# Altium schematic sheet LTC6803-3.SchDoc
size A3
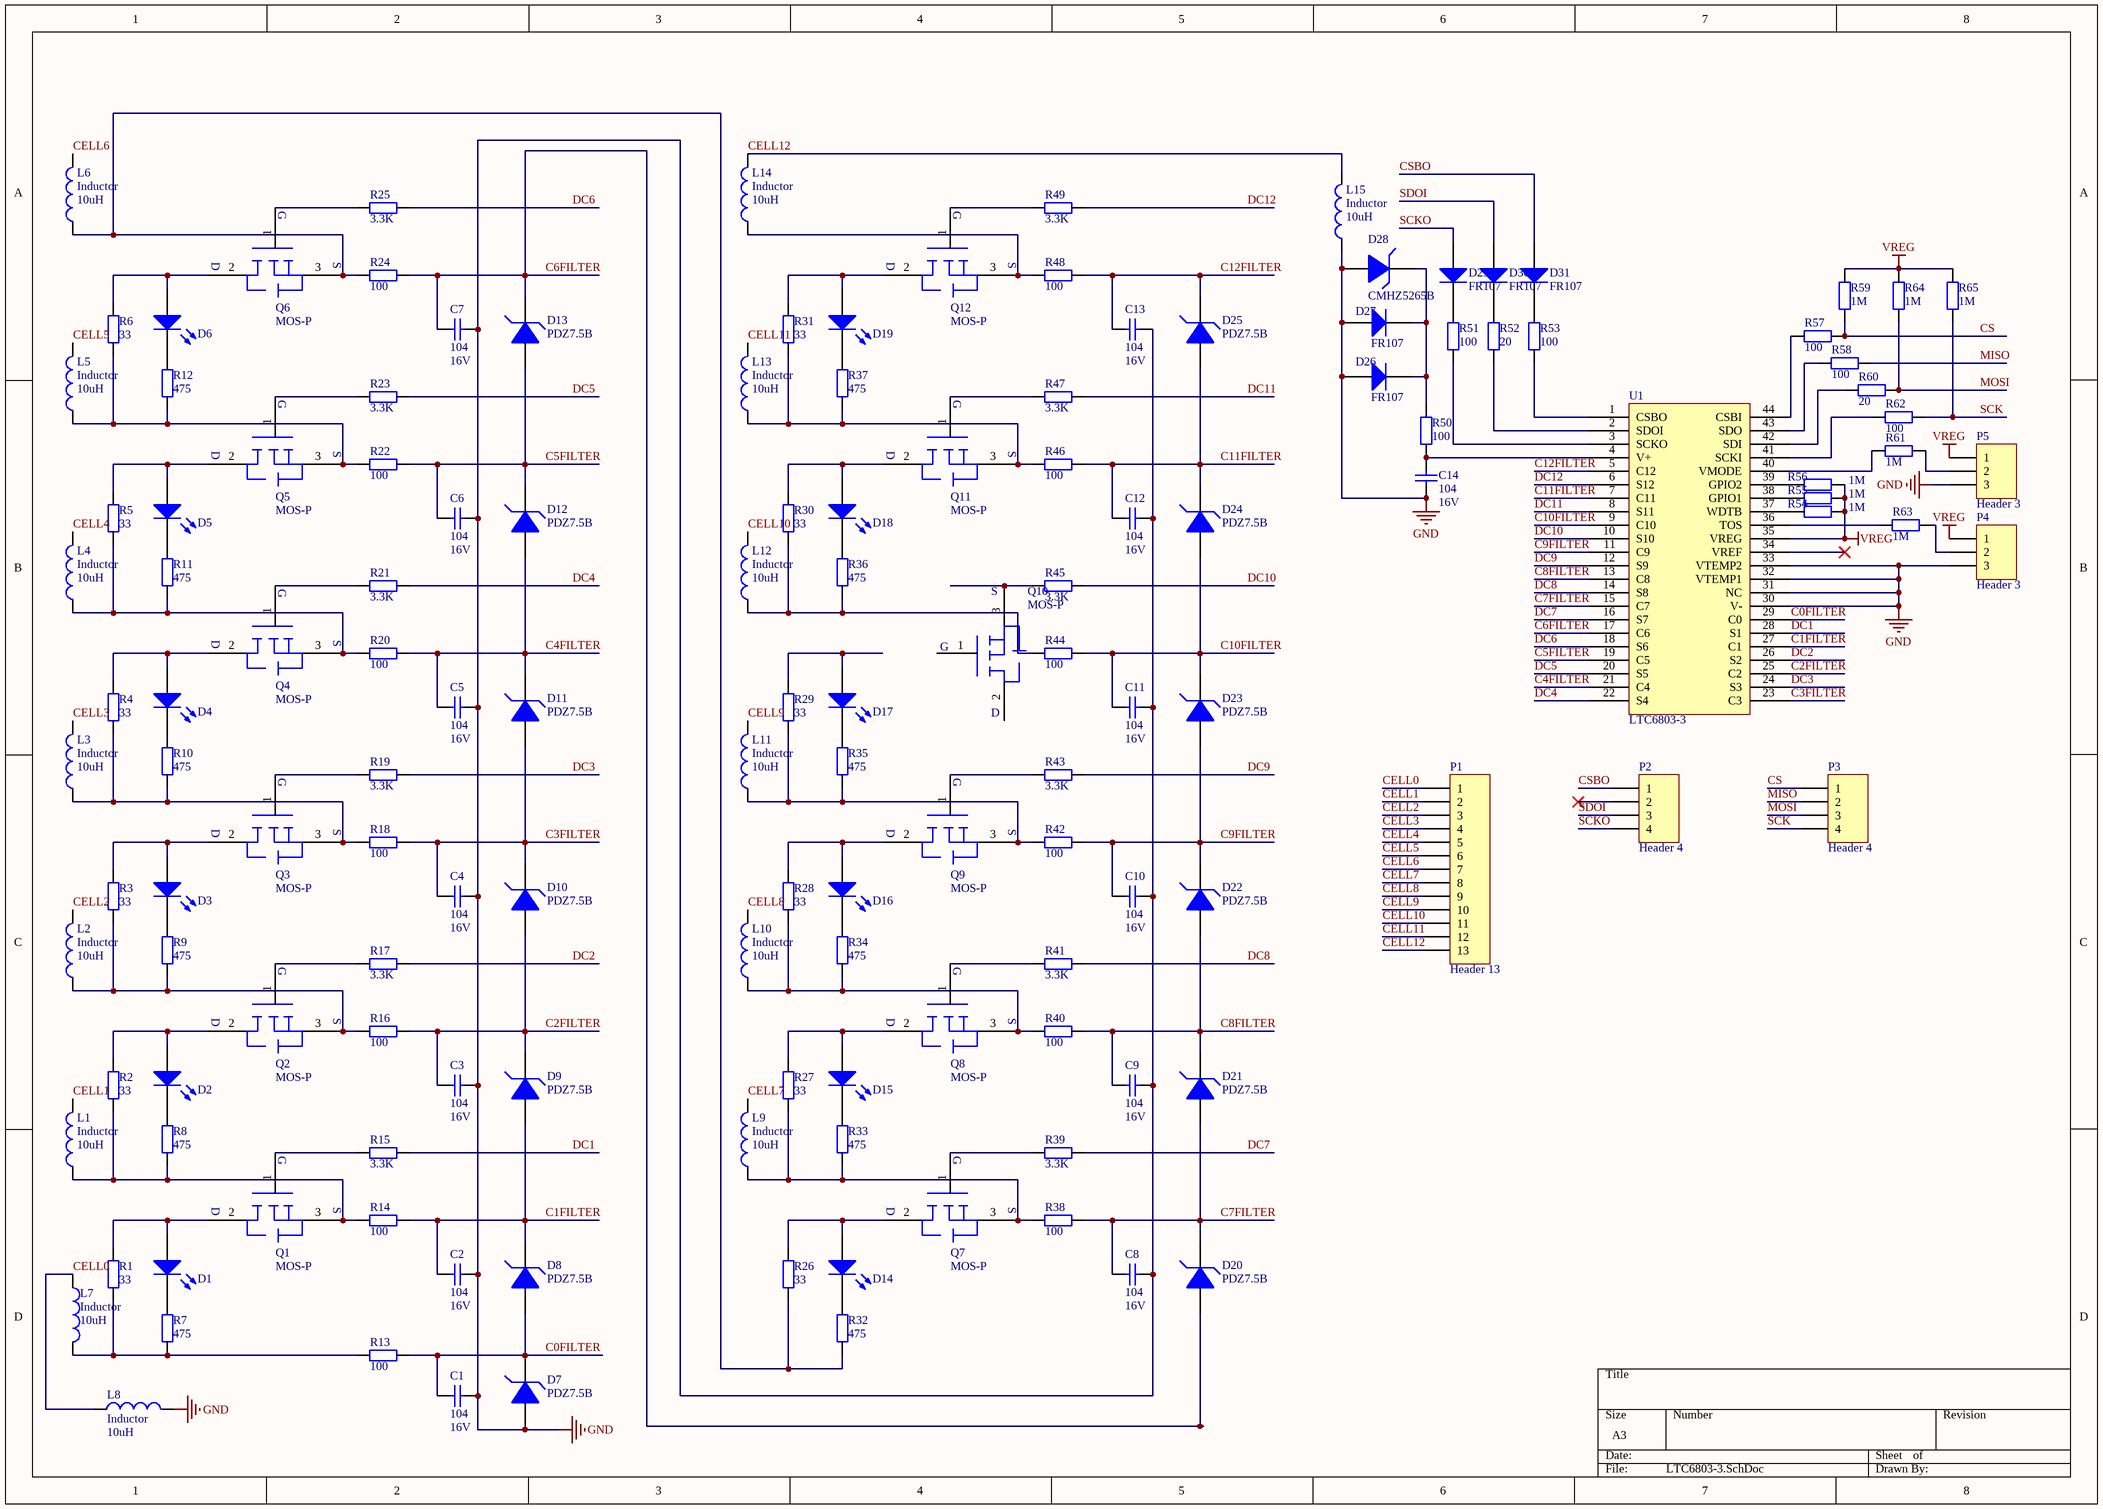
[diagram p0: LTC6803-3.SchDoc]

## Parts
C1  value 104  Pressure Voltage: 16V  [1206]  (hidden comment: Cap)
C2  value 104  Pressure Voltage: 16V  [1206]  (hidden comment: Cap)
C3  value 104  Pressure Voltage: 16V  [1206]  (hidden comment: Cap)
C4  value 104  Pressure Voltage: 16V  [1206]  (hidden comment: Cap)
C5  value 104  Pressure Voltage: 16V  [1206]  (hidden comment: Cap)
C6  value 104  Pressure Voltage: 16V  [1206]  (hidden comment: Cap)
C7  value 104  Pressure Voltage: 16V  [1206]  (hidden comment: Cap)
C8  value 104  Pressure Voltage: 16V  [1206]  (hidden comment: Cap)
C9  value 104  Pressure Voltage: 16V  [1206]  (hidden comment: Cap)
C10  value 104  Pressure Voltage: 16V  [1206]  (hidden comment: Cap)
C11  value 104  Pressure Voltage: 16V  [1206]  (hidden comment: Cap)
C12  value 104  Pressure Voltage: 16V  [1206]  (hidden comment: Cap)
C13  value 104  Pressure Voltage: 16V  [1206]  (hidden comment: Cap)
C14  value 104  Pressure Voltage: 16V  [1206]  (hidden comment: Cap)
D1  LED  [LED_0805]  (value not drawn)
D2  LED  [LED_0805]  (value not drawn)
D3  LED  [LED_0805]  (value not drawn)
D4  LED  [LED_0805]  (value not drawn)
D5  LED  [LED_0805]  (value not drawn)
D6  LED  [LED_0805]  (value not drawn)
D7  PDZ7.5B  [SODFL250X110-2N]
D8  PDZ7.5B  [SODFL250X110-2N]
D9  PDZ7.5B  [SODFL250X110-2N]
D10  PDZ7.5B  [SODFL250X110-2N]
D11  PDZ7.5B  [SODFL250X110-2N]
D12  PDZ7.5B  [SODFL250X110-2N]
D13  PDZ7.5B  [SODFL250X110-2N]
D14  LED  [LED_0805]  (value not drawn)
D15  LED  [LED_0805]  (value not drawn)
D16  LED  [LED_0805]  (value not drawn)
D17  LED  [LED_0805]  (value not drawn)
D18  LED  [LED_0805]  (value not drawn)
D19  LED  [LED_0805]  (value not drawn)
D20  PDZ7.5B  [SODFL250X110-2N]
D21  PDZ7.5B  [SODFL250X110-2N]
D22  PDZ7.5B  [SODFL250X110-2N]
D23  PDZ7.5B  [SODFL250X110-2N]
D24  PDZ7.5B  [SODFL250X110-2N]
D25  PDZ7.5B  [SODFL250X110-2N]
D26  FR107  [DIO-214]
D27  FR107  [DIO-214]
D28  CMHZ5265B  [SODFL372X135-2N]
D29  FR107  [DIO-214]
D30  FR107  [DIO-214]
D31  FR107  [DIO-214]
L1  Inductor  value 10uH  [0805_Inductor]
L2  Inductor  value 10uH  [0805_Inductor]
L3  Inductor  value 10uH  [0805_Inductor]
L4  Inductor  value 10uH  [0805_Inductor]
L5  Inductor  value 10uH  [0805_Inductor]
L6  Inductor  value 10uH  [0805_Inductor]
L7  Inductor  value 10uH  [0805_Inductor]
L8  Inductor  value 10uH  [0805_Inductor]
L9  Inductor  value 10uH  [0805_Inductor]
L10  Inductor  value 10uH  [0805_Inductor]
L11  Inductor  value 10uH  [0805_Inductor]
L12  Inductor  value 10uH  [0805_Inductor]
L13  Inductor  value 10uH  [0805_Inductor]
L14  Inductor  value 10uH  [0805_Inductor]
L15  Inductor  value 10uH  [0805_Inductor]
P1  Header 13  [HDR1X13]
P2  Header 4  [HDR1X4]
P3  Header 4  [HDR1X4]
P4  Header 3  [HDR1X3]
P5  Header 3  [HDR1X3]
Q1  MOS-P  [SOT23_N]
Q2  MOS-P  [SOT23_N]
Q3  MOS-P  [SOT23_N]
Q4  MOS-P  [SOT23_N]
Q5  MOS-P  [SOT23_N]
Q6  MOS-P  [SOT23_N]
Q7  MOS-P  [SOT23_N]
Q8  MOS-P  [SOT23_N]
Q9  MOS-P  [SOT23_N]
Q10  MOS-P  [SOT23_N]
Q11  MOS-P  [SOT23_N]
Q12  MOS-P  [SOT23_N]
R1  value 33  [2512-RESC6332X06N]  (hidden comment: Res)
R2  value 33  [2512-RESC6332X06N]  (hidden comment: Res)
R3  value 33  [2512-RESC6332X06N]  (hidden comment: Res)
R4  value 33  [2512-RESC6332X06N]  (hidden comment: Res)
R5  value 33  [2512-RESC6332X06N]  (hidden comment: Res)
R6  value 33  [2512-RESC6332X06N]  (hidden comment: Res)
R7  value 475  [0805]  (hidden comment: Res)
R8  value 475  [0805]  (hidden comment: Res)
R9  value 475  [0805]  (hidden comment: Res)
R10  value 475  [0805]  (hidden comment: Res)
R11  value 475  [0805]  (hidden comment: Res)
R12  value 475  [0805]  (hidden comment: Res)
R13  value 100  [0805]  (hidden comment: Res)
R14  value 100  [0805]  (hidden comment: Res)
R15  value 3.3K  [0805]  (hidden comment: Res)
R16  value 100  [0805]  (hidden comment: Res)
R17  value 3.3K  [0805]  (hidden comment: Res)
R18  value 100  [0805]  (hidden comment: Res)
R19  value 3.3K  [0805]  (hidden comment: Res)
R20  value 100  [0805]  (hidden comment: Res)
R21  value 3.3K  [0805]  (hidden comment: Res)
R22  value 100  [0805]  (hidden comment: Res)
R23  value 3.3K  [0805]  (hidden comment: Res)
R24  value 100  [0805]  (hidden comment: Res)
R25  value 3.3K  [0805]  (hidden comment: Res)
R26  value 33  [2512-RESC6332X06N]  (hidden comment: Res)
R27  value 33  [2512-RESC6332X06N]  (hidden comment: Res)
R28  value 33  [2512-RESC6332X06N]  (hidden comment: Res)
R29  value 33  [2512-RESC6332X06N]  (hidden comment: Res)
R30  value 33  [2512-RESC6332X06N]  (hidden comment: Res)
R31  value 33  [2512-RESC6332X06N]  (hidden comment: Res)
R32  value 475  [0805]  (hidden comment: Res)
R33  value 475  [0805]  (hidden comment: Res)
R34  value 475  [0805]  (hidden comment: Res)
R35  value 475  [0805]  (hidden comment: Res)
R36  value 475  [0805]  (hidden comment: Res)
R37  value 475  [0805]  (hidden comment: Res)
R38  value 100  [0805]  (hidden comment: Res)
R39  value 3.3K  [0805]  (hidden comment: Res)
R40  value 100  [0805]  (hidden comment: Res)
R41  value 3.3K  [0805]  (hidden comment: Res)
R42  value 100  [0805]  (hidden comment: Res)
R43  value 3.3K  [0805]  (hidden comment: Res)
R44  value 100  [0805]  (hidden comment: Res)
R45  value 3.3K  [0805]  (hidden comment: Res)
R46  value 100  [0805]  (hidden comment: Res)
R47  value 3.3K  [0805]  (hidden comment: Res)
R48  value 100  [0805]  (hidden comment: Res)
R49  value 3.3K  [0805]  (hidden comment: Res)
R50  value 100  [0805]  (hidden comment: Res)
R51  value 100  [0805]  (hidden comment: Res)
R52  value 20  [0805]  (hidden comment: Res)
R53  value 100  [0805]  (hidden comment: Res)
R54  value 1M  [0805]  (hidden comment: Res)
R55  value 1M  [0805]  (hidden comment: Res)
R56  value 1M  [0805]  (hidden comment: Res)
R57  value 100  [0805]  (hidden comment: Res)
R58  value 100  [0805]  (hidden comment: Res)
R59  value 1M  [0805]  (hidden comment: Res)
R60  value 20  [0805]  (hidden comment: Res)
R61  value 1M  [0805]  (hidden comment: Res)
R62  value 100  [0805]  (hidden comment: Res)
R63  value 1M  [0805]  (hidden comment: Res)
R64  value 1M  [0805]  (hidden comment: Res)
R65  value 1M  [0805]  (hidden comment: Res)
U1  LTC6803-3  [SSOP50P780X200-44N]

## Nets
GND: C1.2 C2.2 C3.2 C4.2 C5.2 C6.2 C7.2 C8.2 C9.2 C10.2 C11.2 C12.2 C13.2 C14.1 D7.1(A) D26.1(A) D27.1(A) D28.1(A) L8.2 L15.1 P4.3 P5.3 U1.30(V-) U1.31(NC) U1.32(VTEMP1) U1.33(VTEMP2)
VREG: P4.1 P5.1 R54.1 R55.1 R56.1 R59.1 R64.1 R65.1 U1.35(VREG)
C0FILTER: C1.1 D7.2(K) D8.1(A) R13.2 U1.29(C0)
C1FILTER: C2.1 D8.2(K) D9.1(A) R14.2 U1.27(C1)
C2FILTER: C3.1 D9.2(K) D10.1(A) R16.2 U1.25(C2)
C3FILTER: C4.1 D10.2(K) D11.1(A) R18.2 U1.23(C3)
C4FILTER: C5.1 D11.2(K) D12.1(A) R20.2 U1.21(C4)
C5FILTER: C6.1 D12.2(K) D13.1(A) R22.2 U1.19(C5)
C6FILTER: C7.1 D13.2(K) D20.1(A) R24.2 U1.17(C6)
C7FILTER: C8.1 D20.2(K) D21.1(A) R38.2 U1.15(C7)
C8FILTER: C9.1 D21.2(K) D22.1(A) R40.2 U1.13(C8)
C9FILTER: C10.1 D22.2(K) D23.1(A) R42.2 U1.11(C9)
C10FILTER: C11.1 D23.2(K) D24.1(A) R44.2 U1.9(C10)
C11FILTER: C12.1 D24.2(K) D25.1(A) R46.2 U1.7(C11)
C12FILTER: C13.1 D25.2(K) R48.2 U1.5(C12)
CELL0: L7.1 L8.1 P1.1
CELL1: L1.2 P1.2
CELL2: L2.2 P1.3
CELL3: L3.2 P1.4
CELL4: L4.2 P1.5
CELL5: L5.2 P1.6
CELL6: L6.2 P1.7
CELL7: L9.2 P1.8
CELL8: L10.2 P1.9
CELL9: L11.2 P1.10
CELL10: L12.2 P1.11
CELL11: L13.2 P1.12
CELL12: L14.2 L15.2 P1.13
CS: P3.1 R57.1 R59.2
CSBO: D31.1(A) P2.1
DC1: R15.2 U1.28(S1)
DC2: R17.2 U1.26(S2)
DC3: R19.2 U1.24(S3)
DC4: R21.2 U1.22(S4)
DC5: R23.2 U1.20(S5)
DC6: R25.2 U1.18(S6)
DC7: R39.2 U1.16(S7)
DC8: R41.2 U1.14(S8)
DC9: R43.2 U1.12(S9)
DC10: R45.2 U1.10(S10)
DC11: R47.2 U1.8(S11)
DC12: R49.2 U1.6(S12)
MISO: P3.2 R58.1
MOSI: P3.3 R60.1 R64.2
SCK: P3.4 R62.1 R65.2
SCKO: D29.1(A) P2.4
SDOI: D30.1(A) P2.3
NetC14_2: C14.2 R50.1 U1.4(V+)
NetD1_1: D1.1(A) Q1.2 R1.2
NetD1_2: D1.2(K) R7.2
NetD2_1: D2.1(A) Q2.2 R2.2
NetD2_2: D2.2(K) R8.2
NetD3_1: D3.1(A) Q3.2 R3.2
NetD3_2: D3.2(K) R9.2
NetD4_1: D4.1(A) Q4.2 R4.2
NetD4_2: D4.2(K) R10.2
NetD5_1: D5.1(A) Q5.2 R5.2
NetD5_2: D5.2(K) R11.2
NetD6_1: D6.1(A) Q6.2 R6.2
NetD6_2: D6.2(K) R12.2
NetD14_1: D14.1(A) Q7.2 R26.2
NetD14_2: D14.2(K) R32.2
NetD15_1: D15.1(A) Q8.2 R27.2
NetD15_2: D15.2(K) R33.2
NetD16_1: D16.1(A) Q9.2 R28.2
NetD16_2: D16.2(K) R34.2
NetD17_1: D17.1(A) R29.2
NetD17_2: D17.2(K) R35.2
NetD18_1: D18.1(A) Q11.2 R30.2
NetD18_2: D18.2(K) R36.2
NetD19_1: D19.1(A) Q12.2 R31.2
NetD19_2: D19.2(K) R37.2
NetD26_2: D26.2(K) D27.2(K) D28.2(K) R50.2
NetD29_2: D29.2(K) R51.2
NetD30_2: D30.2(K) R52.2
NetD31_2: D31.2(K) R53.2
NetL1_1: L1.1 Q1.3 R2.1 R8.1 R14.1
NetL2_1: L2.1 Q2.3 R3.1 R9.1 R16.1
NetL3_1: L3.1 Q3.3 R4.1 R10.1 R18.1
NetL4_1: L4.1 Q4.3 R5.1 R11.1 R20.1
NetL5_1: L5.1 Q5.3 R6.1 R12.1 R22.1
NetL6_1: L6.1 Q6.3 R24.1 R26.1 R32.1
NetL7_2: L7.2 R1.1 R7.1 R13.1
NetL9_1: L9.1 Q7.3 R27.1 R33.1 R38.1
NetL10_1: L10.1 Q8.3 R28.1 R34.1 R40.1
NetL11_1: L11.1 Q9.3 R29.1 R35.1 R42.1
NetL12_1: L12.1 R30.1 R36.1 R44.1
NetL13_1: L13.1 Q11.3 R31.1 R37.1 R46.1
NetL14_1: L14.1 Q12.3 R48.1
NetP4_2: P4.2 R63.1
NetP5_2: P5.2 R61.1
NetQ1_1: Q1.1(G) R15.1
NetQ2_1: Q2.1(G) R17.1
NetQ3_1: Q3.1(G) R19.1
NetQ4_1: Q4.1(G) R21.1
NetQ5_1: Q5.1(G) R23.1
NetQ6_1: Q6.1(G) R25.1
NetQ7_1: Q7.1(G) R39.1
NetQ8_1: Q8.1(G) R41.1
NetQ9_1: Q9.1(G) R43.1
NetQ10_3: Q10.3 R45.1
NetQ11_1: Q11.1(G) R47.1
NetQ12_1: Q12.1(G) R49.1
NetR51_1: R51.1 U1.3(SCKO)
NetR52_1: R52.1 U1.2(SDOI)
NetR53_1: R53.1 U1.1(CSBO)
NetR54_2: R54.2 U1.37(WDTB)
NetR55_2: R55.2 U1.38(GPIO1)
NetR56_2: R56.2 U1.39(GPIO2)
NetR57_2: R57.2 U1.44(CSBI)
NetR58_2: R58.2 U1.43(SDO)
NetR60_2: R60.2 U1.42(SDI)
NetR61_2: R61.2 U1.40(VMODE)
NetR62_2: R62.2 U1.41(SCKI)
NetR63_2: R63.2 U1.36(TOS)

Not connected (* = marked no-connect by the designer): P2 2*; Q10 1(G) 2; U1 34(VREF)*

## Notes on the sheet
- (in symbol MOS-P) D; S

## Library data of the parts
C1-C14 = Cap: 原理图绘制者: 刘永钦; 原理图何处使用过: 2014年飞思卡尔底板; 原理图审核人1: 徐鹏飞; 封装0805何处使用: 2015年航行器遥控器; 原理图审核人2: 朱觉文; 封装0603何处使用过: 在2401转接板上使用; 原理图提供者: 刘永钦; 封装0805绘制者: 刘永钦; 封装0805提供者: 刘永钦; 封装0805审核人1: 徐鹏飞; 封装0805审核人2: 朱觉文; 封装0603绘制者: 刘永钦; 封装0603提供者: 刘永钦; 封装0603审核人1: 朱觉文; 封装0603审核人2: 徐鹏飞
D1-D6 D14-D19 = LED: 原理图绘制者: 刘永钦; 原理图何处使用过: 2014年飞思卡尔底板; 原理图审核人1: 徐鹏飞; Color: 蓝色; 封装1210LED何处使用过: 2014年的一个小板子; 封装LED_3mm何处使用过: 2014年变频器面板; 封装LED_0805使用过: 2015年飞思卡尔底板; 原理图审核人2: 朱觉文; 封装LED0603何处使用过: 2401转接板; 原理图提供者: 刘永钦; 封装1210LED绘制者: 刘永钦; 封装1210LED提供者: 刘永钦; 封装1210LED审核人1: 徐鹏飞; 封装LED_3mm绘制者: 刘永钦; 封装LED_3mm提供者: 刘永钦; 封装LED_0805绘制者: 刘永钦; 封装LED_0805提供者: 刘永钦; 封装LED_0805审核人1: 徐鹏飞; 封装1210LED审核人2: 朱觉文; 封装LED_0805审核人2: 朱觉文; 封装LED_3mm审核者2: 朱觉文; 封装LED0603绘制者: 刘永钦; 封装LED0603审核人2: 朱觉文; 封装LED0603提供者: 刘永钦; 封装LED0603审核人1: 徐鹏飞
D26 D27 D29-D31 = 二极管: 原理图绘制者: 赵某某; 原理图提供者: 周某某; 原理图何处使用过: 2014年飞思卡尔运放板; 原理图审核人: 李某某; 封装DIO-214绘制者: 刘永钦; 封装DIO-214审核人1: 徐鹏飞; 封装DIO-214审核人2: 朱觉文; 封装DIO-214提供者: 刘永钦; 封装DIO-214何处使用过: 2014年飞思卡尔运放板
D28 = CMHZ5265B: 62V Zener Diode
L1-L15 = Inductor: 原理图绘制者: 刘永钦; 原理图何处使用过: 2014年飞思卡尔底板; 原理图审核人1: 徐鹏飞; 封装0805_Inductor绘制者: 未知; 封装0805_Inductor使用过: 2015年飞思卡尔底板; 原理图审核人2: 朱觉文; 原理图提供者: 刘永钦; 封装0805_Inductor提供者: 刘永钦; 封装0805_Inductor审核人1: 徐鹏飞; 封装0805_Inductor审核人2: 朱觉文
P1 = Header 13: Header, 13-Pin; LatestRevisionDate: 17-Jul-2002; LatestRevisionNote: Re-released for DXP Platform.; Publisher: Altium Limited
P2 P3 = Header 4: Header, 4-Pin; LatestRevisionDate: 17-Jul-2002; LatestRevisionNote: Re-released for DXP Platform.; Publisher: Altium Limited
P4 P5 = Header 3: Header, 3-Pin; LatestRevisionDate: 17-Jul-2002; LatestRevisionNote: Re-released for DXP Platform.; Publisher: Altium Limited
Q1-Q12 = MOS-P: 原理图审核人2: 朱觉文; 原理图绘制者: 刘永钦; 原理图审核人1: 徐鹏飞; 原理图何处使用过: 无刷直流电机驱动板; 原理图提供者: 刘永钦; 封装MOS_TO-220提供者: 刘永钦; 封装MOS_TO-220审核人1: 徐鹏飞; 封装MOS_TO-220审核人2: 朱觉文; 封装MOS_TO-220何处使用过: 无刷直流电机驱动板; 封装MOS_TO-220绘制者: 刘永钦
R1-R65 = Res: 原理图绘制者: 刘永钦; 原理图何处使用过: 2014年飞思卡尔底板; 原理图审核人1: 徐鹏飞; 封装0805何处使用过: 2015年航行器遥控器; 原理图审核人2: 朱觉文; 封装2512-RESC6332X06N何处使用过: 在无刷直流电机驱动板上使用过; 封装0603何处使用过: 在2401转接板上使用; 原理图提供者: 刘永钦; 封装0805绘制者: 刘永钦; 封装0805提供者: 刘永钦; 封装0805审核人1: 徐鹏飞; 封装0805审核人2: 朱觉文; 封装0603提供者: 刘永钦; 封装0603审核人2: 朱觉文; 封装0603审核人1: 徐鹏飞; 封装2512-RESC6332X06N审核人2: 朱觉文; 封装2512-RESC6332X06N提供者: 刘永钦; 封装2512-RESC6332X06N审核人1: 徐鹏飞; 封装0603绘制者: 刘永钦; 封装2512-RESC6332X06N绘制者: 刘永钦